# Altium schematic sheet PULSE_MUX.SchDoc
size A4; DrawnBy: Jakov Sola; SheetNumber: 3; SheetTotal: 6
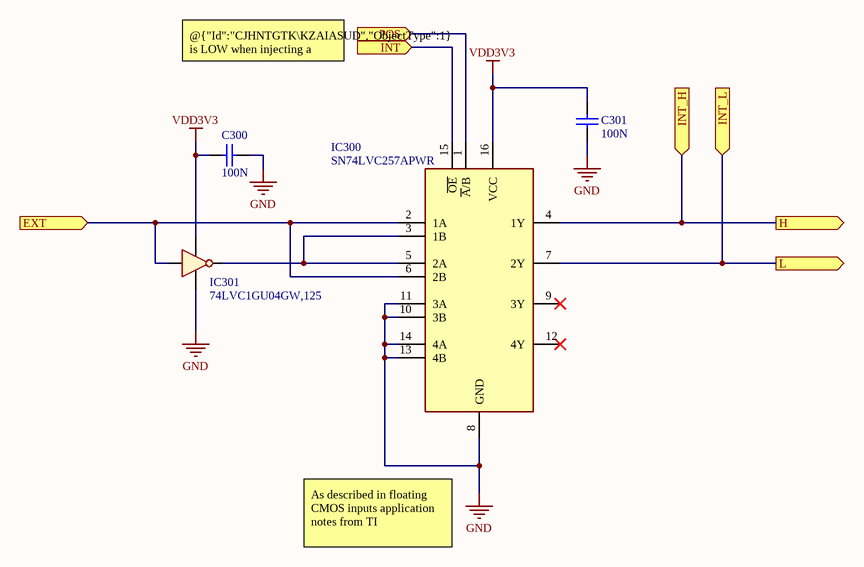
[diagram p0: PULSE_MUX.SchDoc]

## Parts
C300  VALUE_4C: 100N  [CAPC0603N]  (hidden comment: Cap)
C301  VALUE_4C: 100N  [CAPC0603N]  (hidden comment: Cap)
IC300  SN74LVC257APWR  [SOP65P640X120-16N]
IC301  MANUFCODE: 74LVC1GU04GW,125  [SOT65P212X110-5N]  (hidden comment: INV_SINGLE)

## Ports
EXT (in), H (out), INT (in), INT_H (in), INT_L (in), L (out), POS (in)

## Nets
GND: C300.1 C301.1 IC300.8(GND) IC300.10(3B) IC300.11(3A) IC300.13(4B) IC300.14(4A) IC301.3(GND)
VDD3V3: C300.2 C301.2 IC300.16(VCC) IC301.5(GND)
EXT: IC300.2(1A) IC300.6(2B) IC301.2(A) ; port EXT
H: IC300.4(1Y) ; port INT_H, port H
INT: IC300.15(~{OE}) ; port INT
INT_L: IC300.7(2Y) ; port INT_L, port L
POS: IC300.1(~{A}/B) ; port POS
NetIC300_3: IC300.3(1B) IC300.5(2A) IC301.4(Y)

Not connected (* = marked no-connect by the designer): IC300 9(3Y)* 12(4Y)*

## Notes on the sheet
- @{"Id":"CJHNTGTK\KZAIASUD","ObjectType":1} is LOW when injecting a POSITIVE pulse
- As described in floating CMOS inputs application notes from TI
- Project
- Sheet
- Date:
- Drawn By:

## Library data of the parts
C300 C301 = CL10B104KA8WPNC: MANUF: SAMSUNG; DESCR: CAP 100N 0603 25V X7R 10%; VENDOR: DIGI-KEY; VENDORCODE: 1276-6717-1-ND; POPULATE: YES; VALUE: 100N; VOLTAGE: 25V; TOLERANCE: 0.1; MANUFCODE: CL10B104KA8WPNC; PACKAGE: 0603; TECHNOLOGY: X7R
IC300 = SN74LVC257APWR: MANUF: TI; DESCR: IC MUX QUAD 2:1 3 STATE; VENDOR: MOUSER; VENDORCODE: 595-SN74LVC257APWR; POPULATE: YES; MANUFCODE: SN74LVC257APWR
IC301 = 74LVC1GU04GW,125: MANUF: NEXPERIA; DESCR: IC INV SINGLE UNBUFFERED; VENDOR: MOUSER; VENDORCODE: 771-LVC1GU04GW125; POPULATE: YES